# EAGLE design openautopihat (EAGLE 8.2.2)
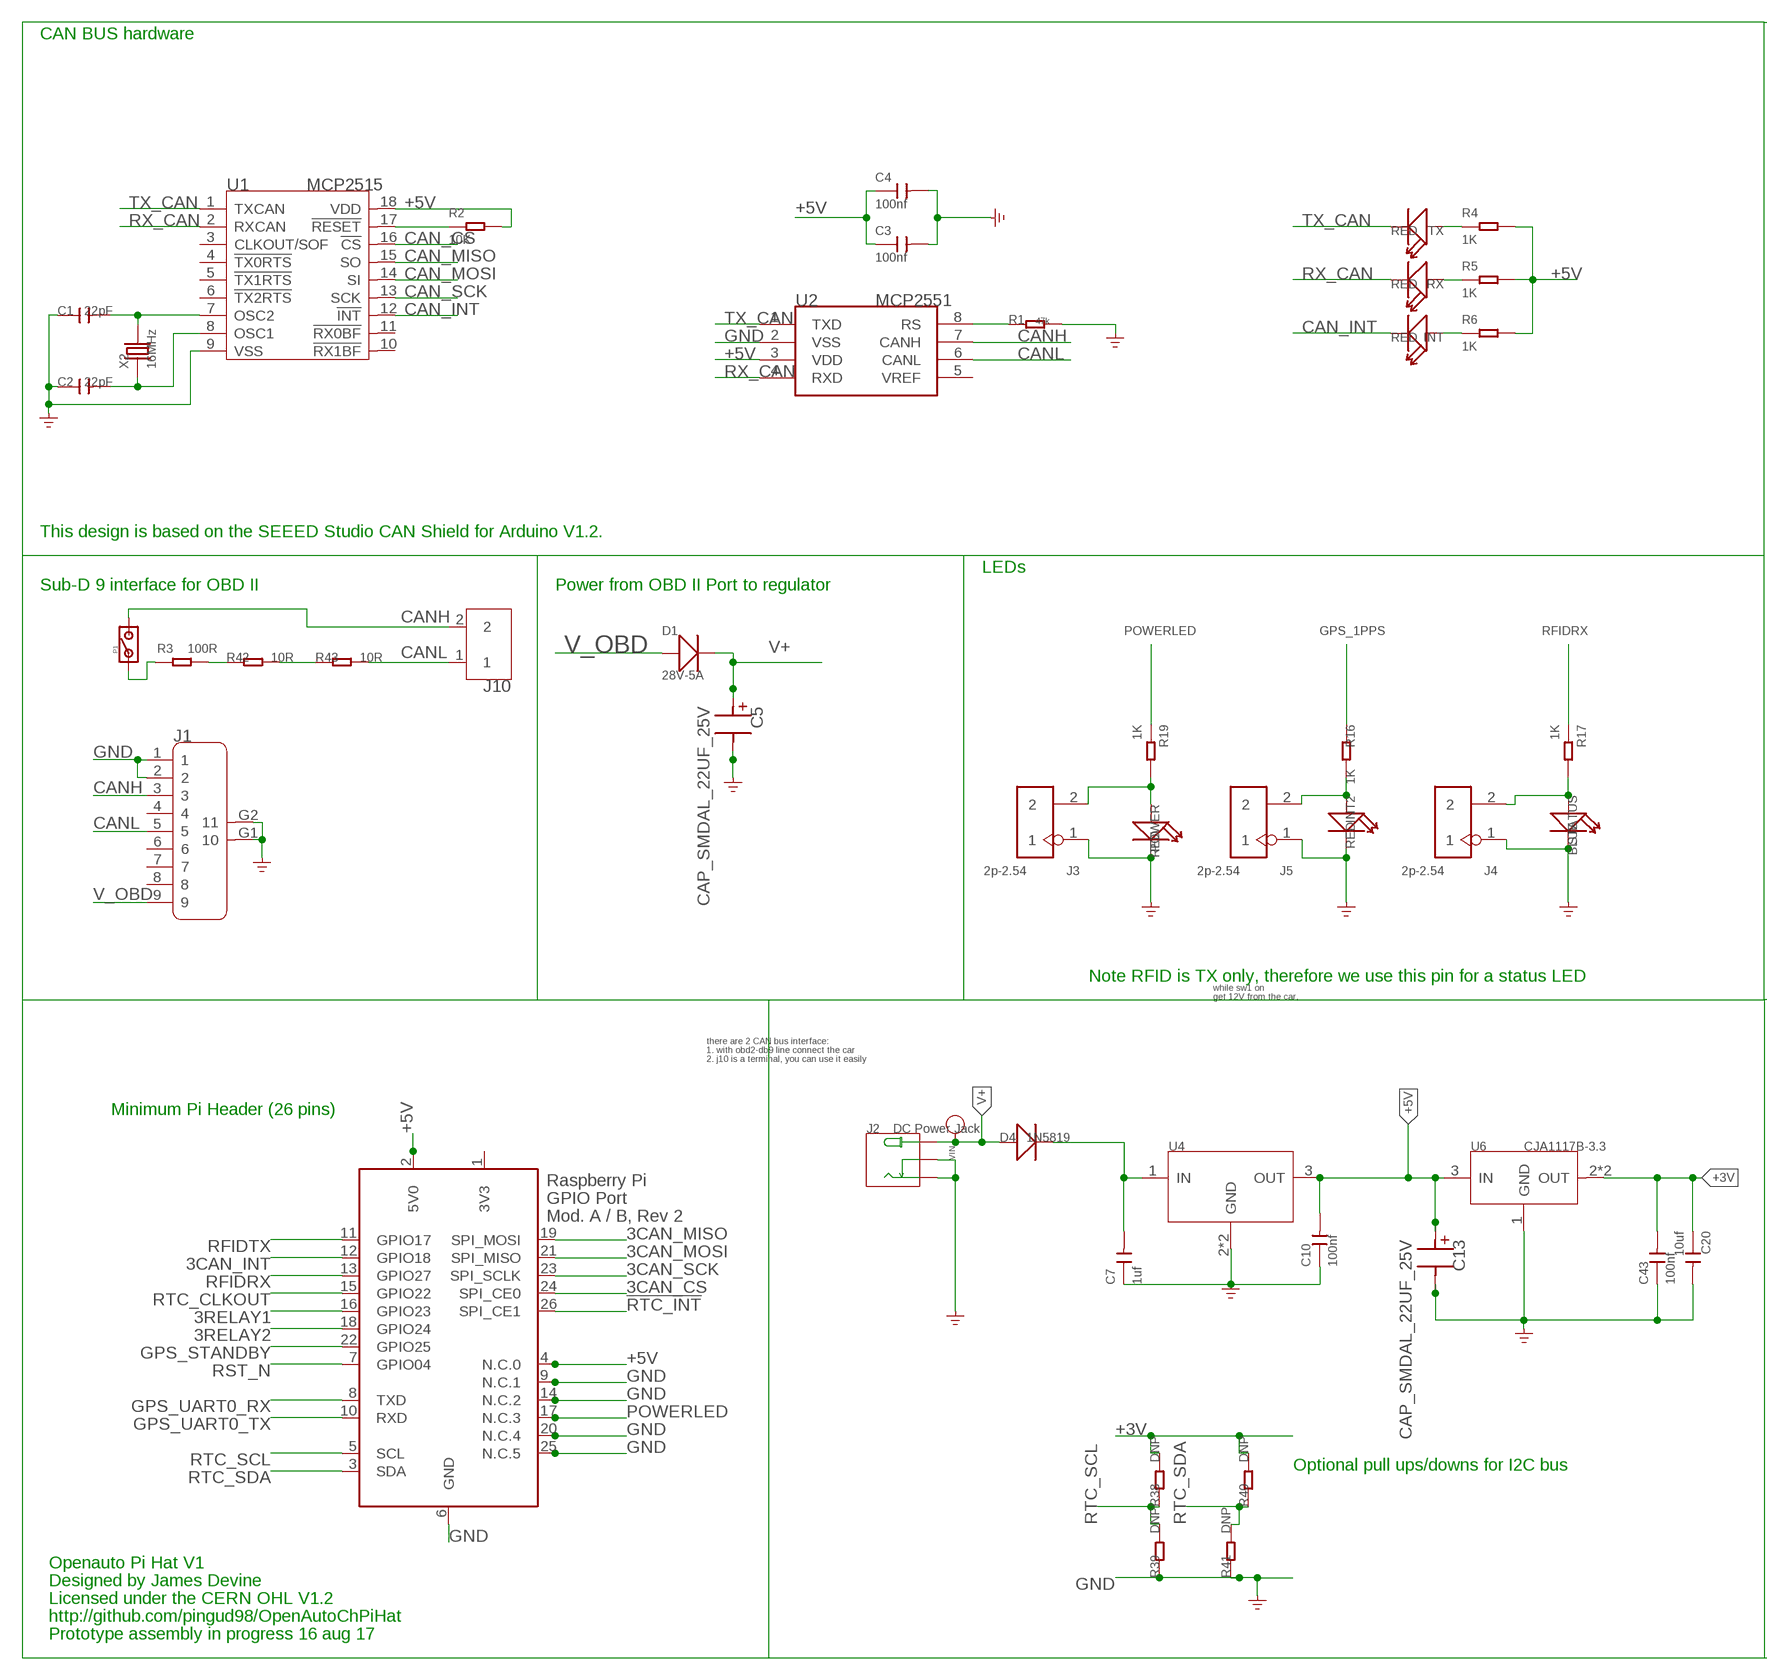
[diagram p0: schematic, sheet 1, part 1 of 2]
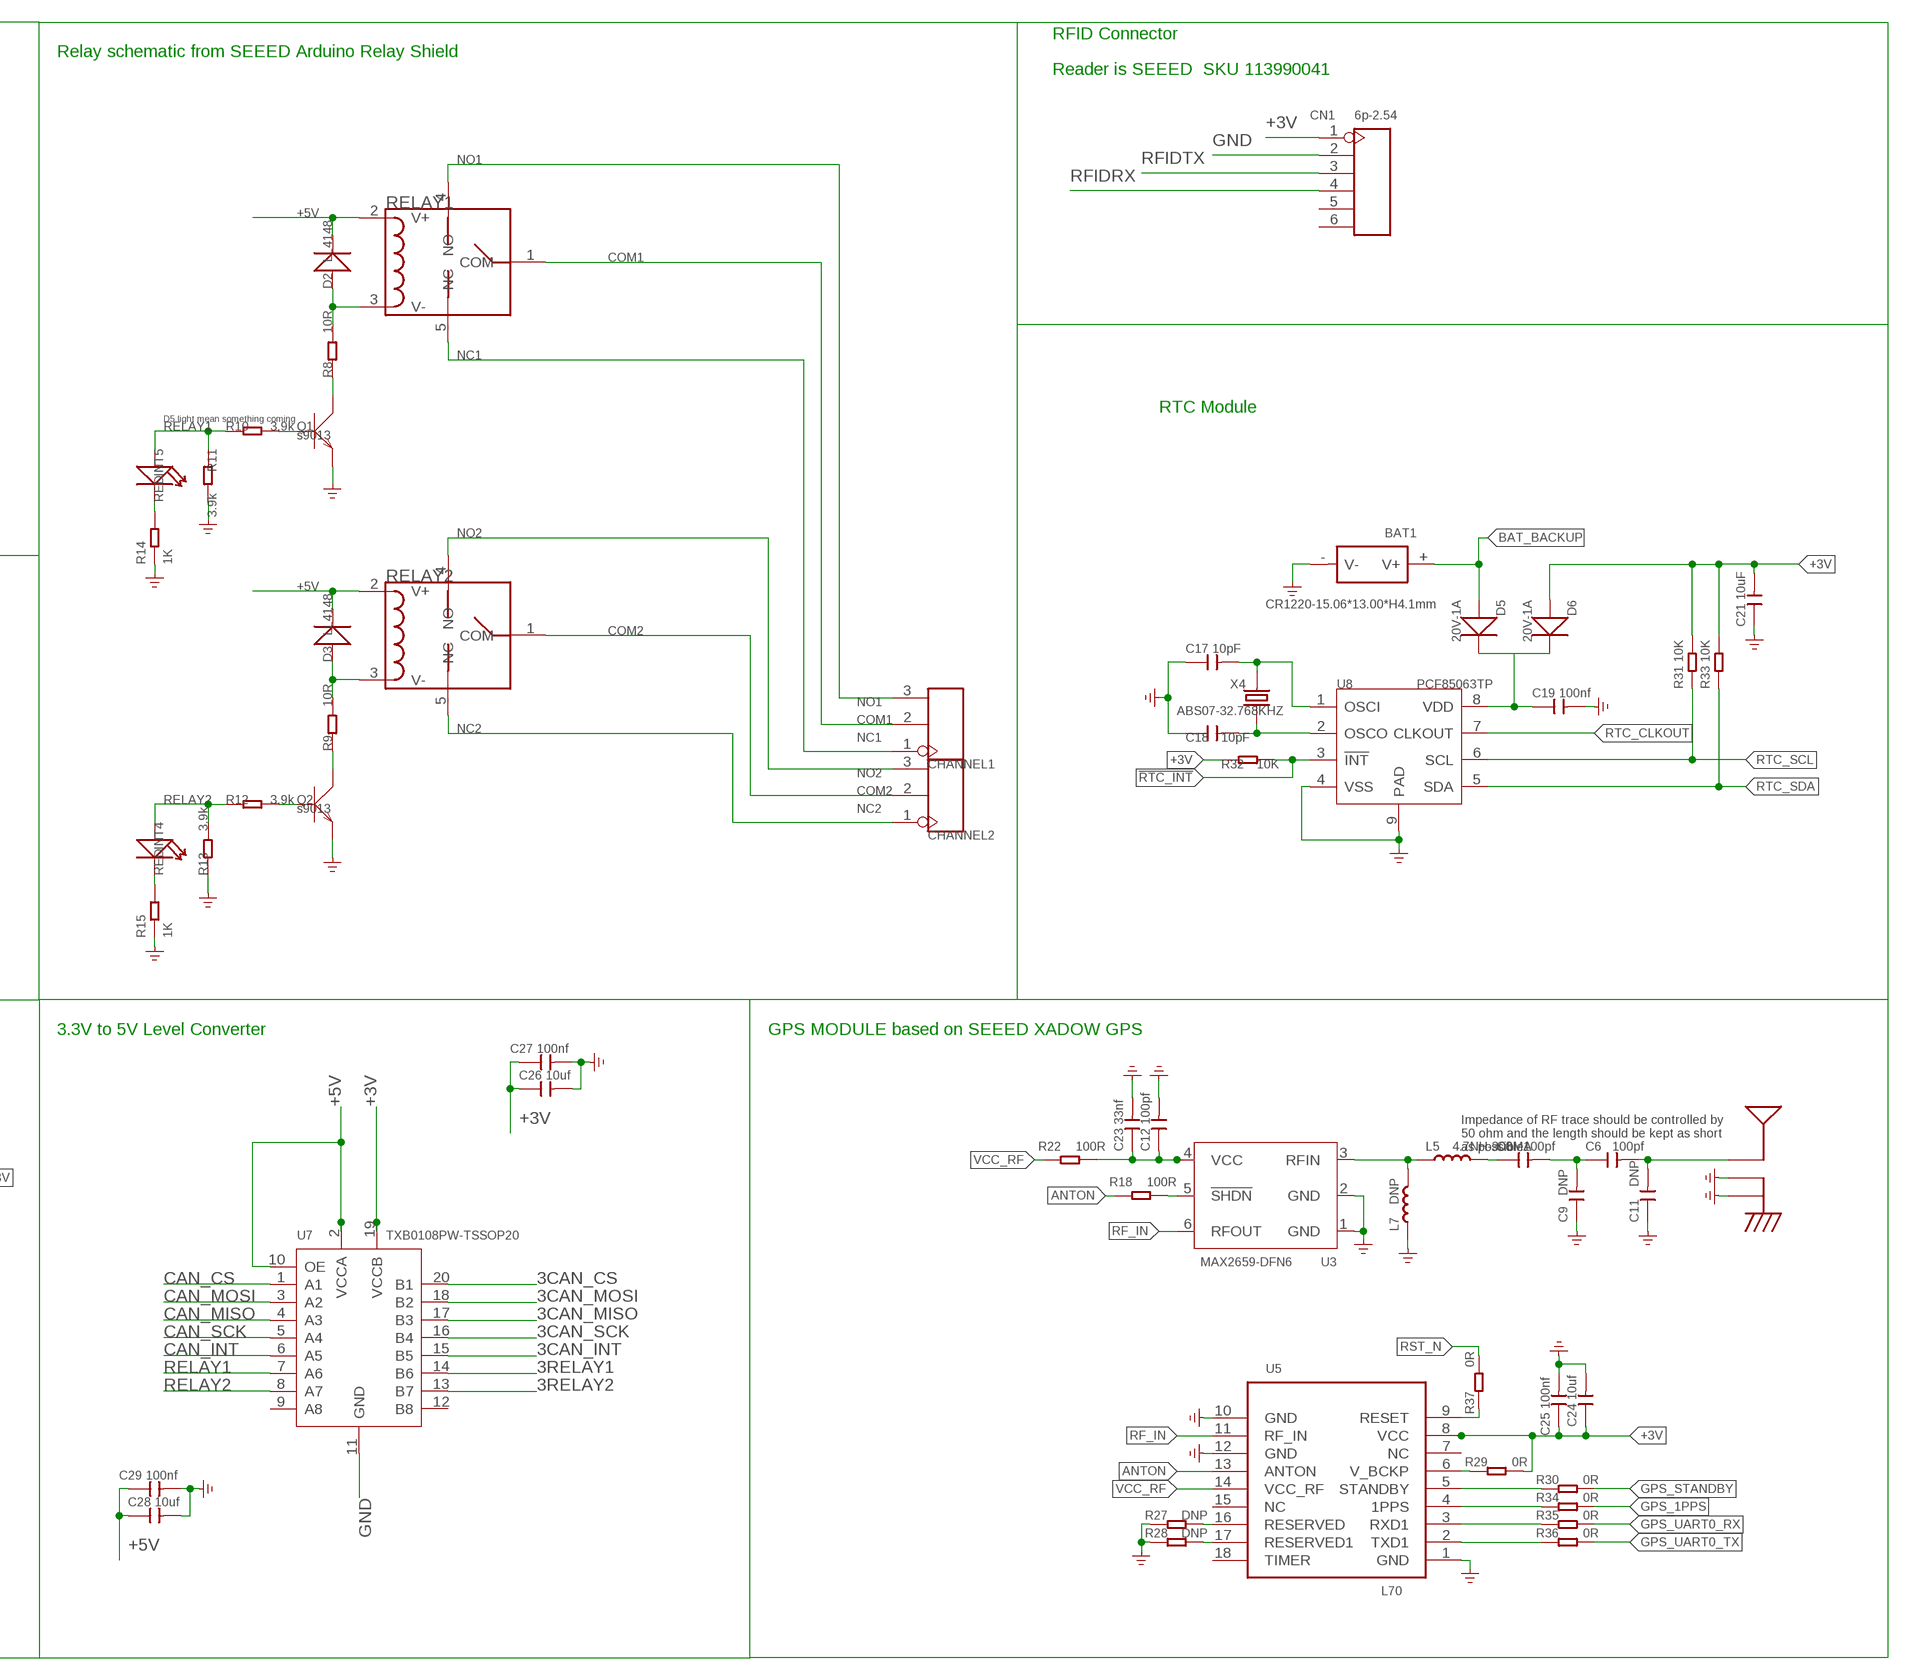
[diagram p1: schematic, sheet 1, part 2 of 2]

## Parts
ANT2  ACD-5036-A3-CC-S  [SMD_ANT5237]
BAT1  CR1220-15.06*13.00*H4.1mm  BAT-HOLDER'SMD-1220'  [BAT2P-SMD-16.4-CR1220]
C1  22pF  C-0603  [C0603]
C2  22pF  C-0603  [C0603]
C3  100nf  CERAMIC-100NF-50V-10%-X7R(0603)  [C0603]
C4  100nf  CERAMIC-100NF-50V-10%-X7R(0603)  [C0603]
C5  CAP_SMDAL_22UF_25V  [CAP_SMD_AL_D50]
C6  100pf  CERAMIC-100PF-50V-5%-NPO(0603)  [C0603]
C7  1uf  CERAMIC-1UF-25V-10%-X7R(0603)  [C0603]
C8  100pf  CERAMIC-100PF-50V-5%-NPO(0603)  [C0603]
C9  DNP  CAP-0201  [C0201]
C10  100nf  CERAMIC-100NF-50V-10%-X7R(0603)  [C0603]
C11  DNP  CAP-0201  [C0201]
C12  100pf  CERAMIC-100PF-50V-5%-NPO(0603)  [C0603]
C13  CAP_SMDAL_22UF_25V  [CAP_SMD_AL_D50]
C17  10pF  CAP-0402  [C0402]
C18  10pF  CAP-0402  [C0402]
C19  100nf  CERAMIC-100NF-50V-10%-X7R(0603)  [C0603]
C20  10uf  CERAMIC-10UF-25V-10%-X5R(0805)  [C0805]
C21  10uF  CAP-0805  [C0805]
C23  33nf  CERAMIC-33NF-50V-10%-X7R(0603)  [C0603]
C24  10uf  CERAMIC-10UF-25V-10%-X5R(0805)  [C0805]
C25  100nf  CERAMIC-100NF-50V-10%-X7R(0603)  [C0603]
C26  10uf  CERAMIC-10UF-25V-10%-X5R(0805)  [C0805]
C27  100nf  CERAMIC-100NF-50V-10%-X7R(0603)  [C0603]
C28  10uf  CERAMIC-10UF-25V-10%-X5R(0805)  [C0805]
C29  100nf  CERAMIC-100NF-50V-10%-X7R(0805)  [C0805]
C43  100nf  CERAMIC-100NF-50V-10%-X7R(0603)  [C0603]
CHANNEL1  SCREW-TERMINAL-3P'3.5'  [3P-3.5]
CHANNEL2  SCREW-TERMINAL-3P'3.5'  [3P-3.5]
CN1  6p-2.54  DIP-BLACK-FEMALE-HEADER-VERT(6P-2.54)  [H6-2.54]
D1  28V-5A  SMD-DIODE-SCHOTTKY-28V-5A(DO-214AA)  [DO-214AA]
D2  LL4148  D'1N4148-SMD'  [LL-34]
D3  LL4148  D'1N4148-SMD'  [LL-34]
D4  1N5819  D'DO-214AC'  [D2010]
D5  20V-1A  SMD-DIODE-SCHOTTKY-20V-1A(SOD-123)  [SOD-123]
D6  20V-1A  SMD-DIODE-SCHOTTKY-20V-1A(SOD-123)  [SOD-123]
INT  RED  LED'0603'  [LED-0603]
INT2  RED  LED'0603'  [LED-0603]
INT4  RED  LED'0603'  [LED-0603]
INT5  RED  LED'0603'  [LED-0603]
J1  DB9'MEAL'  [DB9-MEAL]
J2  DC Power Jack  DC-044  [DC-404]
J3  2p-2.54  DIP-BLACK-MALE-HEADER-VERT(2P-2.54)  [H2-2.54]
J4  2p-2.54  DIP-BLACK-MALE-HEADER-VERT(2P-2.54)  [H2-2.54]
J5  2p-2.54  DIP-BLACK-MALE-HEADER-VERT(2P-2.54)  [H2-2.54]
J10  SCREW-TERMINAL-2P5.0  [2P-5.0]
L5  4.7NH-300MA  SMD-INDUCTOR-4.7NH-0.3NH-300MA(0402)  [L0402]
L7  DNP  INDUCTOR/FERRITE-BEAD-0201  [L0201]
P1  PAD-JUMPER-2P  [2P-SMD-1.78X1.27]
POWER  RED  LED'0603'  [LED-0603]
Q1  s9013  TRANSISTOR-NPN-SOT23  [SOT23]
Q2  s9013  TRANSISTOR-NPN-SOT23  [SOT23]
R1  47k  R-0603  [0603]
R2  10K  SMD-RES-10K-1%-1/8W(0805)  [R0805]
R3  100R  SMD-RES-100R-5%-1/8W(0805)  [R0805]
R4  1K  SMD-RES-1K-1%-1/10W(0603)  [R0603]
R5  1K  SMD-RES-1K-1%-1/10W(0603)  [R0603]
R6  1K  SMD-RES-1K-1%-1/10W(0603)  [R0603]
R8  10R  R-0603  [R0603]
R9  10R  R-0603  [R0603]
R10  3.9k  R-0603  [R0603]
R11  3.9k  R-0603  [R0603]
R12  3.9k  R-0603  [R0603]
R13  3.9k  R-0603  [R0603]
R14  1K  SMD-RES-1K-1%-1/10W(0603)  [R0603]
R15  1K  SMD-RES-1K-1%-1/10W(0603)  [R0603]
R16  1K  R-0603  [R0603]
R17  1K  SMD-RES-1K-1%-1/10W(0603)  [R0603]
R18  100R  SMD-RES-100R-5%-1/8W(0805)  [R0805]
R19  1K  SMD-RES-1K-1%-1/10W(0603)  [R0603]
R22  100R  SMD-RES-100R-5%-1/8W(0805)  [R0805]
R27  DNP  RES-0201  [R0201]
R28  DNP  RES-0201  [R0201]
R29  0R  SMD-RES-0R-5%-1/10W(0603)  [R0603]
R30  0R  SMD-RES-0R-5%-1/10W(0603)  [R0603]
R31  10K  SMD-RES-10K-1%-1/8W(0805)  [R0805]
R32  10K  SMD-RES-10K-1%-1/8W(0805)  [R0805]
R33  10K  SMD-RES-10K-1%-1/8W(0805)  [R0805]
R34  0R  SMD-RES-0R-5%-1/10W(0603)  [R0603]
R35  0R  SMD-RES-0R-5%-1/10W(0603)  [R0603]
R36  0R  SMD-RES-0R-5%-1/10W(0603)  [R0603]
R37  0R  SMD-RES-0R-5%-1/10W(0603)  [R0603]
R38  DNP  R-0603  [R0603]
R39  DNP  R-0603  [R0603]
R40  DNP  R-0603  [R0603]
R41  DNP  R-0603  [R0603]
R42  10R  R-0603  [R0603]
R43  10R  R-0603  [R0603]
RELAY1  RELAY-HLS8L-DC5V-S-C  [5P-19.0X15.5X15.8H]
RELAY2  RELAY-HLS8L-DC5V-S-C  [5P-19.0X15.5X15.8H]
RX  RED  LED'0603'  [LED-0603]
STATUS  BLUE  LED'0603'  [LED-0603]
TX  RED  LED'0603'  [LED-0603]
U1  MCP2515  MCP2515-SOIC18  [SOIC18]
U2  MCP2551  MCP2551-SOIC8  [SOIC8-6.0]
U3  MAX2659-DFN6  AMPLIFIER-MAX2659  [DFN6-0.5-1.5X1.2X0.72MM]
U4  PMIC-ST-L7805CV(TO-220)  [TO-220]
U5  L70  MOUDLE-GPS-L70-HARDWARE  [LGA18-1.1-9.7X10.1X2.5MM]
U6  CJA1117B-3.3  PMIC-CJ1117'SOT89'  [SOT-89]
U7  TXB0108PW-TSSOP20  LOGIC-TXB0108PW(TSSOP20)  [TSSOP20-0.65-6.5X4.4MM]
U8  PCF85063TP  RTC-PCF85063TP  [HWSON8-0.5-2X3X0.75MM]
VIN  PAD-TEST-POINT'4545'  [TP_4545]
X1  RASPI_GPIO_AB_PIN  [RASPI_GPIO_AB_PIN]
X2  16MHz  CRYSTAL-HC49S  [HC49/S]
X4  ABS07-32.768KHZ  CRYSTAL-2P-3215  [X2-SMD-3.2X1.5X0.55MM]

## Nets
3CAN_CS: U7.20(B1) X1.24(SPI_CE0)
3CAN_INT: U7.15(B5) X1.12(GPIO18)
3CAN_MISO: U7.17(B3) X1.19(SPI_MOSI)
3CAN_MOSI: U7.18(B2) X1.21(SPI_MISO)
3CAN_SCK: U7.16(B4) X1.23(SPI_SCLK)
3RELAY1: U7.14(B6) X1.16(GPIO23)
3RELAY2: U7.13(B7) X1.18(GPIO24)
!RTC_INT: R32.2 U8.3(!INT) X1.26(SPI_CE1)
+3V: C20.1 C21.2 C24.1 C25.1 C26.1 C27.1 C43.2 CN1.1 D6.+ R29.1 R31.2 R32.1 R33.2 R38.2 R40.2 U5.8(VCC) U6.2(OUT) U6.4(OUT) U7.19(VCCB)
+5V [5V Line]: C3.1 C4.1 C10.2 C13.P$P C28.1 C29.1 D2.C(-) D3.C(-) R2.2 R4.2 R5.2 R6.2 RELAY1.2(V+) RELAY2.2(V+) U1.18(VDD) U2.3(VDD) U4.3(OUT) U6.3(IN) U7.2(VCCA) U7.10(OE) X1.2(5V0) X1.4(N.C.0)
ANTON: R18.2 U5.13(ANTON)
BAT_BACKUP: BAT1.+(V+) D5.+
CAN_CS: U1.16(!CS) U7.1(A1)
CAN_INT: INT.- U1.12(!INT) U7.6(A5)
CAN_MISO: U1.15(SO) U7.4(A3)
CAN_MOSI: U1.14(SI) U7.3(A2)
CAN_SCK: U1.13(SCK) U7.5(A4)
CANH: J1.3 J10.2 P1.2 U2.7(CANH)
CANL: J1.5 J10.1 R43.2 U2.6(CANL)
COM1: CHANNEL1.2 RELAY1.1(COM)
COM2: CHANNEL2.2 RELAY2.1(COM)
GND [Batt]: ANT2.GND1 ANT2.GND2 BAT1.-(V-) C1.1 C2.1 C3.2 C4.2 C5.P$M C7.1 C9.1 C10.1 C11.1 C12.2 C13.P$M C17.1 C18.1 C19.2 C20.2 C21.1 C23.2 C24.2 C25.2 C26.2 C27.2 C28.2 C29.2 C43.1 CN1.2 INT2.- J1.1 J1.2 J1.G1 J1.G2 J2.- J2.CDN J3.1 J4.1 J5.1 L7.1 POWER.- Q1.2(E) Q2.2(E) R1.2 R11.2 R13.1 R14.1 R15.1 R27.2 R28.2 R39.1 R41.1 STATUS.- U1.9(VSS) U2.2(VSS) U3.1(GND) U3.2(GND) U4.2(GND) U4.HEAT(GND) U5.1(GND) U5.10(GND) U5.12(GND) U6.1(GND) U7.11(GND) U8.4(VSS) U8.9(PAD) X1.6(GND) X1.9(N.C.1) X1.14(N.C.2) X1.20(N.C.4) X1.25(N.C.5) ; supply symbol labelled GND_POWER
GPS_1PPS: R16.1 R34.1
GPS_STANDBY: R30.1 X1.22(GPIO25)
GPS_UART0_RX: R35.1 X1.8(TXD)
GPS_UART0_TX: R36.1 X1.10(RXD)
N$2: R4.1 TX.+
N$4 [5V Line]: Q2.1(B) R12.2
N$5 [5V Line]: D3.A(+) R9.2 RELAY2.3(V-)
N$6 [5V Line]: Q1.3(C) R8.1
N$7 [5V Line]: D2.A(+) R8.2 RELAY1.3(V-)
N$8 [5V Line]: Q2.3(C) R9.1
N$9: INT2.+ J5.2 R16.2
N$10: J4.2 R17.2 STATUS.+
N$11: R3.1 R42.1
N$12: INT5.- R14.2
N$13: INT4.- R15.2
N$15: R5.1 RX.+
N$16: C1.2 U1.7(OSC2) X2.2
N$17: C2.2 U1.8(OSC1) X2.1
N$19: INT.+ R6.1
N$20: R1.1 U2.8(RS)
N$23 [5V Line]: Q1.1(B) R10.2
N$26 [Batt]: C7.2 D4.- U4.1(IN)
N$29: J3.2 POWER.+ R19.2
N$30: P1.1 R3.2
N$31: C6.1 C8.2 C9.2
N$32: ANT2.FEED C6.2 C11.2
N$33: L5.1 L7.2 U3.3(RFIN)
N$34: C8.1 L5.2
N$35: R18.1 U3.5(!SHDN)
N$36: C12.1 C23.1 R22.1 U3.4(VCC)
N$37: R27.1 U5.16(RESERVED)
N$38: R28.1 U5.17(RESERVED1)
N$39: R29.2 U5.6(V_BCKP)
N$40: C18.2 U8.2(OSCO) X4.1
N$41: C17.2 U8.1(OSCI) X4.2
N$42: R30.2 U5.5(STANDBY)
N$43: R34.2 U5.4(1PPS)
N$44: R37.2 U5.9(RESET)
N$45: R42.2 R43.1
N$49: C19.1 D5.- D6.- U8.8(VDD)
NC1: CHANNEL1.1 RELAY1.5(NC)
NC2: CHANNEL2.1 RELAY2.5(NC)
NO1: CHANNEL1.3 RELAY1.4(NO)
NO2: CHANNEL2.3 RELAY2.4(NO)
POWERLED: R19.1 X1.17(N.C.3)
RELAY1 [5V Line]: INT5.+ R10.1 R11.1 U7.7(A6)
RELAY2: INT4.+ R12.1 R13.2 U7.8(A7)
RF_IN: U3.6(RFOUT) U5.11(RF_IN)
RFIDRX: CN1.4 R17.1 X1.13(GPIO27)
RFIDTX: CN1.3 X1.11(GPIO17)
RST_N: R2.1 R37.1 U1.17(!RESET) X1.7(GPIO04)
RTC_CLKOUT: U8.7(CLKOUT) X1.15(GPIO22)
RTC_SCL: R31.1 R38.1 R39.2 U8.6(SCL) X1.5(SCL)
RTC_SDA: R33.1 R40.1 R41.2 U8.5(SDA) X1.3(SDA)
RX_CAN: RX.- U1.2(RXCAN) U2.4(RXD)
RXD1: R35.2 U5.3(RXD1)
TX_CAN: TX.- U1.1(TXCAN) U2.1(TXD)
TXD1: R36.2 U5.2(TXD1)
V+ [Batt]: C5.P$P D1.- D4.+ J2.+ VIN.T
V_OBD [Batt]: D1.+ J1.9
VCC_RF: R22.2 U5.14(VCC_RF)
Unconnected: CN1.5 CN1.6 J1.4 J1.6 J1.7 J1.8 U1.3(CLKOUT/SOF) U1.4(!TX0RTS) U1.5(!TX1RTS) U1.6(!TX2RTS) U1.10(!RX1BF) U1.11(!RX0BF) U2.5(VREF) U5.7(NC) U5.15(NC) U5.18(TIMER) U7.9(A8) U7.12(B8)

## Notes on the sheet
- CAN BUS hardware | RFID Connector
- Relay schematic from SEEED Arduino Relay Shield
- Reader is SEEED  SKU 113990041
- RTC Module
- D5 light mean something coming
- This design is based on the SEEED Studio CAN Shield for Arduino V1.2.
- LEDs
- Sub-D 9 interface for OBD II | Power from OBD II Port to regulator
- Note RFID is TX only, therefore we use this pin for a status LED
- while sw1 on
- get 12V from the car,
- 3.3V to 5V Level Converter | GPS MODULE based on SEEED XADOW GPS
- there are 2 CAN bus interface:
- 1. with obd2-db9 line connect the car
- 2. j10 is a terminal, you can use it easily
- Minimum Pi Header (26 pins)
- Impedance of RF trace should be controlled by 
  50 ohm and the length should be kept as short 
  as possible.
- short route
- Optional pull ups/downs for I2C bus
- Openauto Pi Hat V1
- Designed by James Devine
- Licensed under the CERN OHL V1.2
- http://github.com/pingud98/OpenAutoChPiHat
- Prototype assembly in progress 16 aug 17

## Power pins joined to a net without a drawn wire
3V3: X1.1(3V3)

## Library data of the parts
ANT2 = Seeed-OPL-2017-01-Antenna-akita:ACD-5036-A3-CC-S: SMD Built-in Antenna for GPSz;3P-5.2*3.7*0.7mm Inpad;ACD-5036-A3-CC-S SKU: 3180020
BAT1 = Connector-new:BAT-HOLDER: BAT2P-13.5-CR1220:320170002;BAT2P-SMD-20.5-CR1632:320170007;METAL-CR2032-D20.0*H6.3MM:320170003;METAL-CR2032-SMD:320170006;PLASTIC-CR1220-L15.06*W13.0*H4.1MM:320170000;PLASTIC-CR2032-L25.2*W15.6*H5.2MM:320170005;BAT2P-11.55-D12.55-CR1220:313010022
C1 C2 = Discrete:C*: Ceramic Capacitors
C3 C4 C10 C19 C25 C27 C43 = Seeed-Capacitor:CERAMIC-100NF-50V-10%-X7R(0603): 302010138; MPN: CC0603KRX7R9BB104
C5 C13 = Seeed-OPL-2017-01-Capacitor-akita:CAP_SMDAL_22UF_25V: SMD CAP Aluminum 22uF-25V;D5.0*H5.4mm SKU: 302030003
C6 C8 C12 = Seeed-Capacitor:CERAMIC-100PF-50V-5%-NPO(0603): 302010076; MPN: CC0603JRNPO9BN101
C7 = Seeed-Capacitor:CERAMIC-1UF-25V-10%-X7R(0603): 302010139; MPN: CC0603KRX7R8BB105
C9 C11 C17 C18 C21 = Discrete-new:CAP: Ceramic Capacitors
C20 C24 C26 C28 = Seeed-Capacitor:CERAMIC-10UF-25V-10%-X5R(0805): 302010178; MPN: CC0805KKX5R8BB106
C23 = Seeed-Capacitor:CERAMIC-33NF-50V-10%-X7R(0603): 302010088; MPN: CC0603KRX7R9BB333
C29 = Seeed-Capacitor:CERAMIC-100NF-50V-10%-X7R(0805): 302010165; MPN: CC0805KRX7R9BB104
CHANNEL1 CHANNEL2 = Connector :SCREW-TERMINAL-3P
CN1 = Seeed-Connector:DIP-BLACK-FEMALE-HEADER-VERT(6P-2.54): 320030060; MPN: F185-1106A1BSYC1
D1 = Seeed-Diode:SMD-DIODE-SCHOTTKY-28V-5A(DO-214AA): 304020021; MPN: SS54B
D2-D4 = discrete:D*
D5 D6 = Seeed-Diode:SMD-DIODE-SCHOTTKY-20V-1A(SOD-123): 304020034; MPN: B5819W
INT INT2 INT4 INT5 POWER RX STATUS TX = Discrete:LED*
J1 = Connector:DB9
J2 = For_Test_Albert:DC-044
J3-J5 = Seeed-Connector:DIP-BLACK-MALE-HEADER-VERT(2P-2.54): 320020016; MPN: P125-1102A0BS116A1
J10 = Connector:SCREW-TERMINAL-2P
L5 = Seeed-Inductor:SMD-INDUCTOR-4.7NH-0.3NH-300MA(0402): 303010037; MPN: LQG15HS4N7S02
L7 = Discrete-new:INDUCTOR/FERRITE-BEAD
P1 = Discrete:PAD-JUMPER-2P
Q1 Q2 = discrete:TRANSISTOR-NPN*: NPN audion
R1 = Discrete:R*
R2 R31-R33 = Seeed-Resistor:SMD-RES-10K-1%-1/8W(0805): 301010361; MPN: RC0805FR-0710KL
R3 R18 R22 = Seeed-Resistor:SMD-RES-100R-5%-1/8W(0805): 301010319; MPN: RC0805JR-07100RL
R4-R6 R14 R15 R17 R19 = Seeed-Resistor:SMD-RES-1K-1%-1/10W(0603): 301010298; MPN: RC0603FR-071KL
R8-R13 R16 R38-R43 = discrete:R*
R27 R28 = Discrete-new:RES
R29 R30 R34-R37 = Seeed-Resistor:SMD-RES-0R-5%-1/10W(0603): 301010292; MPN: RC0603JR-070RL
RELAY1 RELAY2 = discrete:RELAY-HLS8L-DC5V-S-C
U1 = IC:MCP2515: Stand-Alone CAN Controller With SPI Interface
U2 = IC:MCP2551: High-Speed CAN Transceiver http://ww1.microchip.com/downloads/en/devicedoc/21667f.pdf
U3 = IC-new:AMPLIFIER-MAX2659: GPS/GNSS Low-Noise Amplifier; MPN: MAX2659
U4 = Seeed-IC:PMIC-ST-L7805CV(TO-220): 310030010; MPN: L7805CV
U5 = moudle-new:MOUDLE-GPS-L70-HARDWARE: L70 GPS module; MPN: L70
U6 = IC-new:PMIC-CJ*1117: Low Drop Fixed And Adjustable Positive Voltage Regulators http://www.datasheetcatalog.org/datasheet/SGSThomsonMicroelectronics/mXuqtqv.pdf
U7 = Seeed-IC:LOGIC-TXB0108PW(TSSOP20): 310050024; MPN: TXB0108PW
U8 = IC-new:RTC-PCF85063TP
VIN = discrete:PAD-TEST-POINT; PARTNO: DNP
X1 = raspberrypi_bastelstube_v13:RASPI_GPIO_AB: Only the 2x13 header connector, nothing else
X2 = Discrete:CRYSTAL*: CRYSTAL
X4 = Discrete-new:CRYSTAL-2P

## Net classes
0 default: width 0.152 mm, drill 0.152 mm, clearance 0.152 mm
1 Batt: width 0.305 mm, drill 0.152 mm, clearance 0.152 mm
2 5V Line: width 0.203 mm, drill 0.152 mm, clearance 0.152 mm

## Board
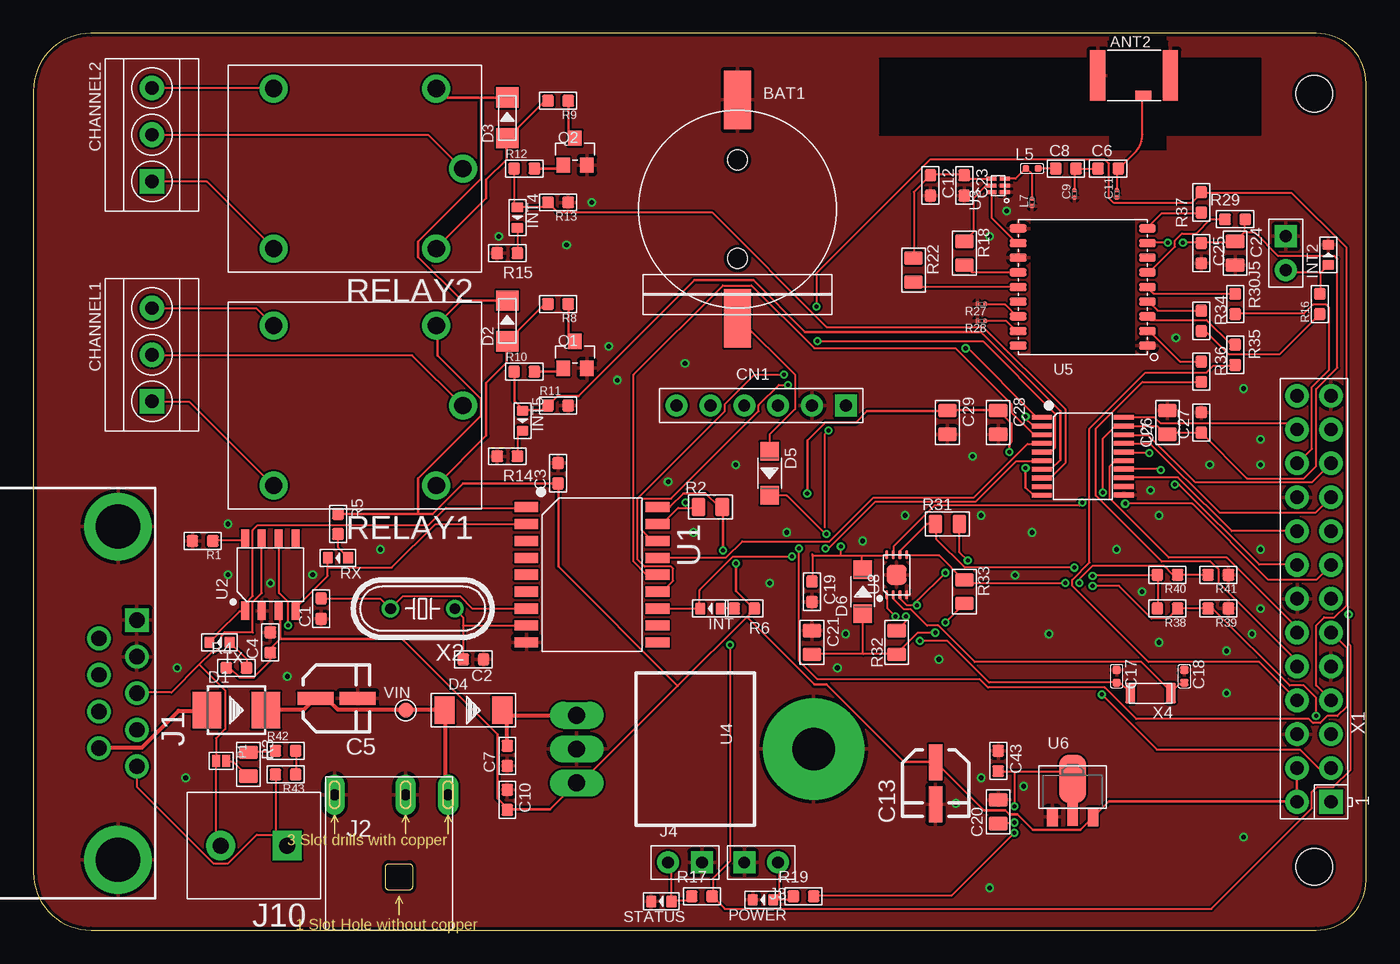
[diagram p2: board, top side]
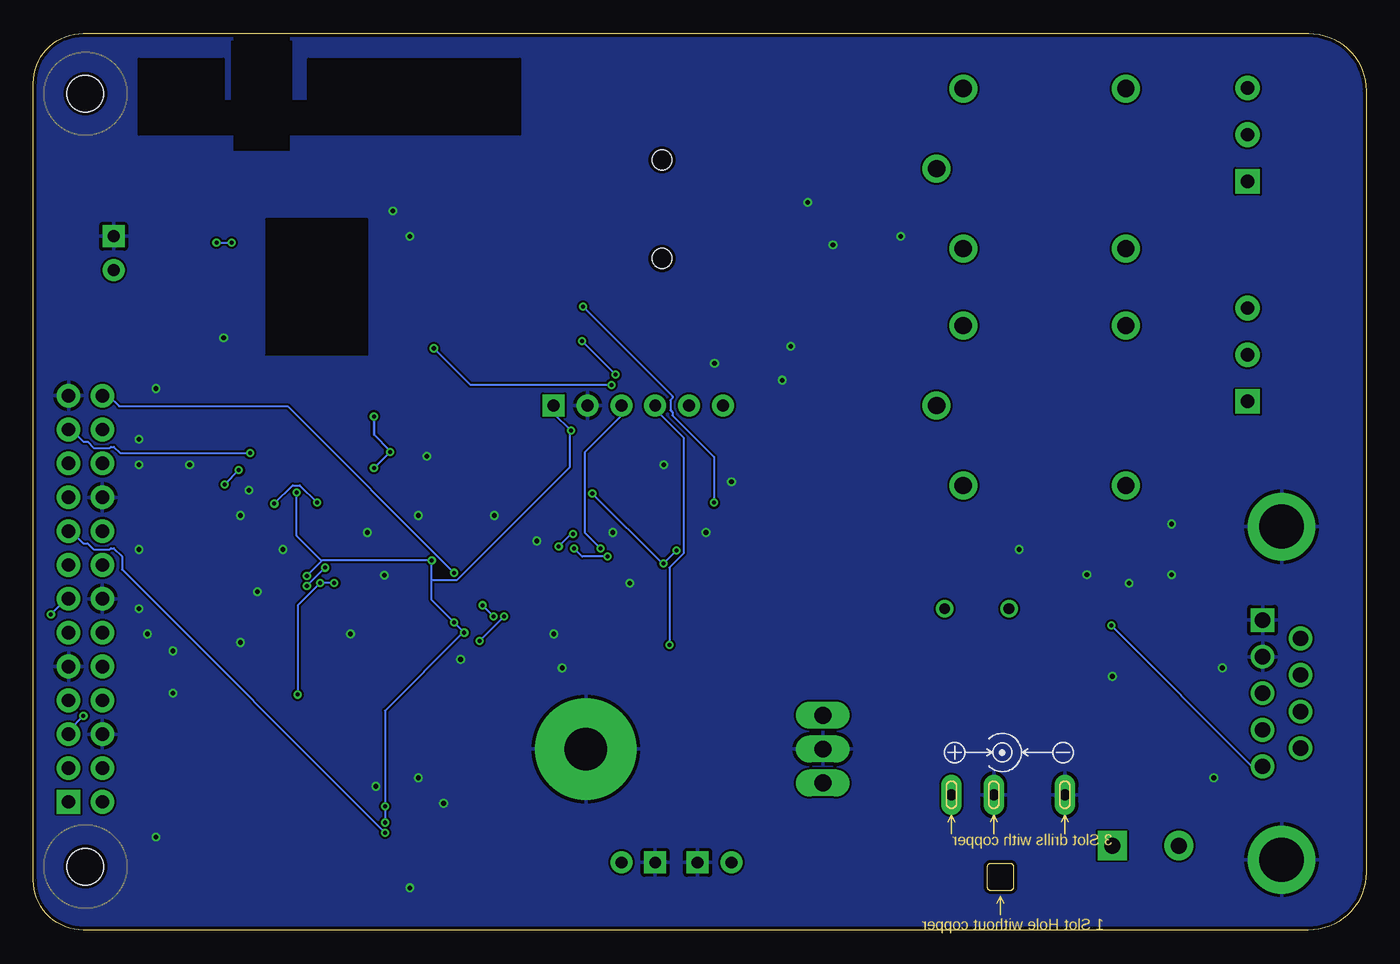
[diagram p3: board, bottom side, seen from below]

Size 100 x 67.3 mm. Coordinates in mm from the lower left corner, seen from the top.
Outline: 96.26,67.3 4.32,67.3 arc90 0,62.98 0,4.34 arc90 4.34,0 96.25,0 arc90 100,3.75 100,63.56 arc90 96.26,67.3
Copper layers (1*16): Top 0.035mm / dielectric 1.5mm / Bottom 0.035mm
Design rules "SeeedStudio_2layer_DRU_no_angle_20140221": minimum track width 6mil, minimum drill 12mil, track to track 6mil, track to pad 6mil, pad to pad 6mil, via to via 6mil, smd to smd 0mil, copper to edge 10mil, drill to drill 10mil, minimum pad ring 10mil, minimum via ring 6mil, stop-mask expansion 2mil, vias tented up to drill 100mil, thermal gap 10mil
Holes 2.75 mm at 96.09,4.77 96.09,62.77
tKeepout: area 63.5,59.7 to 82.5,66.7; area 82.5,59.7 to 92.1,66.7; area 74.9,43.2 to 82.5,53.3
bKeepout: area 63.5,59.7 to 82.5,66.7; area 82.5,59.7 to 92.1,66.7; area 74.9,43.2 to 82.5,53.3; area 74.9,43.2 to 82.5,53.3
tRestrict: area 82.5,59.7 to 92.1,66.7; area 63.5,59.7 to 82.5,66.7; area 74.9,43.2 to 82.5,53.3
bRestrict: area 63.5,59.7 to 82.5,66.7; area 82.5,59.7 to 92.1,66.7; area 74.9,43.2 to 82.5,53.3

### Footprints (pad centres in the part's own frame; a part is rotated, then mirrored left to right if it is on the bottom)
SMD_ANT5237 = smd 0.75 x 1.2: FEED 1.525,0.7 | smd 3.8 x 1.15: GND1 0,2.725; GND2 0,-2.725
BAT2P-SMD-16.4-CR1220 = smd 2 x 4.4: + 0,-8.2; - 0,8.2 | hole 1.5: 0,3.7; 0,-3.7
C0603 = smd 0.889 x 0.889: 1 -0.762,0; 2 0.762,0
C0603' = smd 0.889 x 0.889: 1 0,0.762; 2 0,-0.762
CAP_SMD_AL_D50 = smd 1 x 2.7: P$M 0,-1.6; P$P 0,1.56
C0201 = smd 0.279 x 0.318: 1 -0.279,0; 2 0.279,0
C0402 = smd 0.635 x 0.635: 1 0,0.484; 2 0,-0.484
C0805 = smd 1.397 x 1.016: 1 0,0.889; 2 0,-0.889
3P-3.5 = drill 1 pad 1.85 square: 1 0,-3.5 | drill 1 pad 1.85: 2 0,0; 3 0,3.5
H6-2.54 = drill 0.889 pad 1.651 square: 1 0,6.35 | drill 0.889 pad 1.651: 2 0,3.81; 3 0,1.27; 4 0,-1.27; 5 0,-3.81; 6 0,-6.35
DO-214AA = smd 2.159 x 2.743: + -2.21,0; - 2.21,0
LL-34 = smd 1.524 x 1.676: A -1.524,0; C 1.524,0
D2010 = smd 1.524 x 2.032: + -2.159,0; - 2.159,0
SOD-123 = smd 1.397 x 1.397: + -1.651,0; - 1.651,0
LED-0603 = smd 0.762 x 0.889: + -0.762,0; - 0.762,0
DB9-MEAL = drill 1.143 pad 1.778 square: 1 -5.486,1.422 | drill 1.143 pad 1.778: 2 -2.743,1.422; 3 0,1.422; 4 2.743,1.422; 5 5.486,1.422; 6 -4.115,-1.422; 7 -1.372,-1.422; 8 1.372,-1.422; 9 4.115,-1.422 | drill 3.302 pad 5.08: G1 12.497,0; G2 -12.497,0
DC-404 = drill 0.813 pad 1.524 long: + 3.175,10.16; - -5.334,10.16; CDN 0,10.16
H2-2.54 = drill 0.889 pad 1.651 square: 1 0,1.27 | drill 0.889 pad 1.651: 2 0,-1.27
2P-5.0 = drill 1.2 pad 2.184 square: 1 0,0 | drill 1.2 pad 2.184: 2 5,0
L0402 = smd 0.5 x 0.5: 1 -0.463,0; 2 0.463,0
L0201 = smd 0.279 x 0.318: 1 -0.279,0; 2 0.279,0
2P-SMD-1.78X1.27 = smd 0.889 x 0.61: 1 0,0.381; 2 0,-0.381
SOT23 = smd 1.016 x 1.143: 1 -0.889,-1.016; 2 0.889,-1.016; 3 0,1.016
0603 = smd 0.889 x 0.889: 1 -0.762,0; 2 0.762,0
R0805 = smd 1.397 x 1.016: 1 0,0.889; 2 0,-0.889
R0603 = smd 0.889 x 0.889: 1 0,0.762; 2 0,-0.762
R0603' = smd 0.889 x 0.889: 1 -0.762,0; 2 0.762,0
R0201 = smd 0.279 x 0.318: 1 -0.279,0; 2 0.279,0
5P-19.0X15.5X15.8H = drill 1.3 pad 2.1: 1 -8.1,0; 2 -6.1,-6; 3 -6.1,6; 4 6.1,-6; 5 6.1,6
SOIC18 = smd 0.762 x 1.778: 1 -5.08,-4.915; 2 -3.81,-4.915; 3 -2.54,-4.915; 4 -1.27,-4.915; 5 0,-4.915; 6 1.27,-4.915; 7 2.54,-4.915; 8 3.81,-4.915; 9 5.08,-4.915; 10 5.08,4.915; 11 3.81,4.915; 12 2.54,4.915; 13 1.27,4.915; 14 0,4.915; 15 -1.27,4.915; 16 -2.54,4.915; 17 -3.81,4.915; 18 -5.08,4.915
SOIC8-6.0 = smd 0.6 x 1.4: 1 -1.905,-2.7; 2 -0.635,-2.7; 3 0.635,-2.7; 4 1.905,-2.7; 5 1.905,2.7; 6 0.635,2.7; 7 -0.635,2.7; 8 -1.905,2.7
DFN6-0.5-1.5X1.2X0.72MM = smd 0.3 x 0.75: 1 -0.5,-0.5; 2 0,-0.5; 3 0.5,-0.5; 4 0.5,0.5; 5 0,0.5; 6 -0.5,0.5
TO-220 = drill 1.27 pad 2.032 long: 1 -2.54,-11.43; 2 0,-11.43; 3 2.54,-11.43 | drill 3.2 pad 7.62: HEAT 0,6.35
LGA18-1.1-9.7X10.1X2.5MM = smd 1.27 x 0.635: 1 4.85,-4.4; 2 4.85,-3.3; 3 4.85,-2.2; 4 4.85,-1.1; 5 4.85,0; 6 4.85,1.1; 7 4.85,2.2; 8 4.85,3.3; 9 4.85,4.4; 10 -4.85,4.4; 11 -4.85,3.3; 12 -4.85,2.2; 13 -4.85,1.1; 14 -4.85,0; 15 -4.85,-1.1; 16 -4.85,-2.2; 17 -4.85,-3.3; 18 -4.85,-4.4
SOT-89 = smd 0.8 x 1.4: 1 -1.524,-1.905; 3 1.524,-1.905 | smd 0.8 x 1.9: 2 0,-1.651 | smd 2.032 x 3.65: 4 0,0.94
TSSOP20-0.65-6.5X4.4MM = smd 0.35 x 1.5: 1 -2.925,-3.065; 2 -2.275,-3.065; 3 -1.625,-3.065; 4 -0.975,-3.065; 5 -0.325,-3.065; 6 0.325,-3.065; 7 0.975,-3.065; 8 1.625,-3.065; 9 2.275,-3.065; 10 2.925,-3.065; 11 2.91,3.065; 12 2.26,3.065; 13 1.61,3.065; 14 0.96,3.065; 15 0.325,3.065; 16 -0.325,3.065; 17 -0.975,3.065; 18 -1.625,3.065; 19 -2.275,3.065; 20 -2.925,3.065
HWSON8-0.5-2X3X0.75MM = smd 0.25 x 0.7: 1 -0.75,-1.5; 2 -0.25,-1.5; 3 0.25,-1.5; 4 0.75,-1.5; 5 0.75,1.5; 6 0.25,1.5; 7 -0.25,1.5; 8 -0.75,1.5 | smd 1.5 x 1.5: 9 0,0
TP_4545 = smd 1.143 x 1.143: T 0,0
RASPI_GPIO_AB_PIN = drill 1 pad 1.778 square: 1 -15.24,-1.27 | drill 1 pad 1.778: 2 -15.24,1.27; 3 -12.7,-1.27; 4 -12.7,1.27; 5 -10.16,-1.27; 6 -10.16,1.27; 7 -7.62,-1.27; 8 -7.62,1.27; 9 -5.08,-1.27; 10 -5.08,1.27; 11 -2.54,-1.27; 12 -2.54,1.27; 13 0,-1.27; 14 0,1.27; 15 2.54,-1.27; 16 2.54,1.27; 17 5.08,-1.27; 18 5.08,1.27; 19 7.62,-1.27; 20 7.62,1.27; 21 10.16,-1.27; 22 10.16,1.27; 23 12.7,-1.27; 24 12.7,1.27; 25 15.24,-1.27; 26 15.24,1.27
HC49/S = drill 0.813: 1 -2.413,0; 2 2.413,0
X2-SMD-3.2X1.5X0.55MM = smd 0.762 x 1.524: 1 -1.524,0; 2 1.524,0

### Placement (x,y rotation side)
ANT2  82.58,64.14 270 top
BAT1  52.83,54.1 0 top
C1  21.59,24.13 90 top
C2  33.02,20.32 180 top
C3  100nf  [C0603']  39.37,34.29 180 top
C4  100nf  [C0603']  17.78,21.59 180 top
C5  22.73,17.4 90 top
C6  100pf  [C0603']  80.64,57.15 90 top
C7  1uf  [C0603']  35.56,13.08 180 top
C8  100pf  [C0603']  77.47,57.15 90 top
C9  78.11,55.24 90 top
C10  100nf  [C0603']  35.56,9.78 0 top
C11  81.28,55.24 90 top
C12  100pf  [C0603']  67.31,55.88 0 top
C13  67.69,11.05 0 top
C17  81.28,19.05 0 top
C18  86.36,19.05 0 top
C19  100nf  [C0603']  58.42,25.4 0 top
C20  72.39,8.89 180 top
C21  58.42,21.59 0 top
C23  33nf  [C0603']  69.85,55.88 0 top
C24  90.17,50.8 0 top
C25  100nf  [C0603']  87.63,50.8 0 top
C26  85.09,38.1 180 top
C27  100nf  [C0603']  87.63,38.1 180 top
C28  72.39,38.1 0 top
C29  68.58,38.1 0 top
C43  100nf  [C0603']  72.39,12.7 0 top
CHANNEL1  8.89,43.18 0 top
CHANNEL2  8.89,59.69 0 top
CN1  54.61,39.37 270 top
D1  15.24,16.51 0 top
D2  35.56,45.72 90 top
D3  35.56,60.96 90 top
D4  33.02,16.51 0 top
D5  55.24,34.29 270 top
D6  62.23,25.4 90 top
INT  50.8,24.13 180 top
INT2  97.16,50.67 90 top
INT4  36.32,53.47 270 top
INT5  36.7,38.23 270 top
J1  6.35,17.78 270 top
J2  27.94,0 0 top
J3  54.61,5.08 90 top
J4  48.9,5.08 270 top
J5  93.98,50.8 0 top
J10  19.05,6.35 180 top
L5  74.93,57.15 0 top
L7  74.93,54.61 90 top
P1  14.1,12.7 270 top
POWER  54.74,2.29 180 top
Q1  40.64,43.18 0 top
Q2  40.64,58.42 0 top
R1  12.7,29.21 180 top
R2  50.8,31.75 90 top
R3  16.13,12.45 0 top
R4  15.24,19.68 270 top
R5  22.86,30.48 180 top
R6  53.34,24.13 90 top
R8  10R  [R0603']  39.37,46.99 180 top
R9  10R  [R0603']  39.37,62.23 180 top
R10  3.9k  [R0603']  36.83,41.91 0 top
R11  3.9k  [R0603']  39.37,39.37 0 top
R12  3.9k  [R0603']  36.83,57.15 0 top
R13  3.9k  [R0603']  39.37,54.61 180 top
R14  35.56,35.56 90 top
R15  35.56,50.8 90 top
R16  1K  [R0603']  96.52,46.99 90 top
R17  50.16,2.54 270 top
R18  69.85,50.8 0 top
R19  57.78,2.54 270 top
R22  66.04,49.53 0 top
R27  71.12,46.99 180 top
R28  71.12,45.72 180 top
R29  90.17,53.34 270 top
R30  90.17,46.99 180 top
R31  68.58,30.48 90 top
R32  64.77,21.59 180 top
R33  69.85,25.4 0 top
R34  87.63,45.72 180 top
R35  90.17,43.18 180 top
R36  87.63,41.91 180 top
R37  87.63,54.61 0 top
R38  DNP  [R0603']  85.09,24.13 180 top
R39  DNP  [R0603']  88.9,24.13 180 top
R40  DNP  [R0603']  85.09,26.67 180 top
R41  DNP  [R0603']  88.9,26.67 180 top
R42  10R  [R0603']  18.92,13.46 0 top
R43  10R  [R0603']  18.92,11.68 180 top
RELAY1  24.13,39.37 180 top
RELAY2  24.13,57.15 180 top
RX  22.86,27.94 180 top
STATUS  47.12,2.16 180 top
TX  13.97,21.59 180 top
U1  41.91,26.67 270 top
U2  17.78,26.67 0 top
U3  72.39,55.88 90 top
U4  52.2,13.59 270 top
U5  78.74,48.26 0 top
U6  77.98,10.41 0 top
U7  78.74,35.56 270 top
U8  64.77,26.67 0 top
VIN  27.94,16.51 0 top
X1  96.09,24.87 90 top
X2  29.21,24.13 180 top
X4  83.82,17.78 180 top

### Tracks (layer width: path | path; a pad name or v marks a point on that pad's centre or on a via)
3CAN_CS
  Top 0.152: U7.20 81.84,38.48 84.12,38.48 84.58,38.02 94.34,38.02 94.79,37.57 X1.24
3CAN_INT
  Top 0.152: U7.15 81.76,35.2 81.15,35.2 80.77,34.82 80.77,32.38 85.19,27.96 89.53,27.96 94.79,22.71 94.79,22.33 X1.12
3CAN_MISO
  Top 0.152: U7.17 81.84,36.5 83.82,36.5 89,31.32 96.16,31.32 97.31,32.46 X1.19
3CAN_MOSI
  Top 0.152: X1.21 95.94,33.6 87.17,33.6 83.67,37.11 81.84,37.11 U7.18
3CAN_SCK  (via drill 0.3)
  Top 0.152: v83.74,35.81 81.84,35.81 U7.16
  Bottom 0.152: v83.74,35.81 93.5,35.81 93.95,36.27 94.18,36.27 94.26,36.2 95.48,36.2 95.94,36.65 96.24,36.65 97.16,37.57 X1.23
3RELAY1  (via drill 0.3)
  Top 0.152: v84.58,34.52 84.51,34.59 81.84,34.59 U7.14 | v85.65,33.45 85.95,33.45 91.97,27.43 94.79,27.43 X1.16
  Bottom 0.152: v85.65,33.45 v84.58,34.52
3RELAY2
  Top 0.152: X1.18 89.92,29.95 85.88,33.98 81.84,33.98 U7.13
!RTC_INT  (via drill 0.3)
  Top 0.152: v65.46,23.55 65.46,23.16 R32.2 | U8.3 65.08,25.15 65.08,24.84 65.53,24.38 v66.29,24.38 66.29,24.69 v68.43,26.82
  Bottom 0.152: v65.46,23.55 v66.29,24.38 | v68.43,26.82 80.92,39.32 93.57,39.32 94.34,40.08 94.79,40.08 X1.26
+3V  (via drill 0.3)
  Top 0.152: 59.36,30.25 59.36,37.19 v59.66,37.49 | 73.61,11.89 77.5,11.89 77.95,11.43 U6.4 78.03,11.35 78.03,8.76 U6.2 | 73.61,11.89 72.39,11.89 C43.2 | C20.1 73.53,8 v73.61,8.08 | 73.61,11.89 v73.61,9.3 | 87.63,51.59 90.07,51.59 C24.1 90.87,52.39 | 90.87,52.39 90.91,52.43 90.91,53.34 R29.1 | v85.11,51.59 83.59,51.59 U5.8 | 87.63,51.59 v86.26,51.59 | 87.63,51.59 C25.1 | R38.2 84.35,24.16 84.35,26.67 R40.2 79.55,26.67 v79.48,26.59 | 64.77,20.73 62.26,20.73 | 62.26,20.73 58.45,20.73 C21.2 | v68.43,23.09 R33.2 | v67.67,22.33 66.37,22.33 64.77,20.73 | 64.77,20.73 R32.1 | v70.1,27.74 69.49,28.35 69.49,30.48 R31.2 | v80.24,32.84 80.24,36.88 81.15,37.8 81.76,37.8 U7.19 81.84,37.8 84.35,37.8 84.89,37.26 85.04,37.26 C26.1 85.11,37.26 85.19,37.34 C27.1 91.06,33.91 95.33,33.91 96.24,34.82 96.24,40.62 97.84,42.22 97.84,50.37 97.61,50.6 93.42,50.6 91.67,52.35 90.91,52.35 90.87,52.39 | 62.26,20.73 62.26,23.7 D6.+
  Bottom 0.152: CN1.1 60.96,38.79 v59.66,37.49 59.74,37.49 59.74,34.75 68.2,26.29 70.1,26.29 | v73.61,8.08 v73.61,9.3 73.61,16.46 67.74,22.33 v67.67,22.33 v68.43,23.09 70.1,24.77 70.1,26.29 | v86.26,51.59 v85.11,51.59 | 70.1,26.29 v70.1,27.74 78.33,27.74 78.37,27.7 | 78.37,27.7 v79.48,26.59 | v80.24,32.84 80.24,29.57 78.37,27.7
+5V  (via drill 0.3)
  Top 0.203: 33.6,62.48 30.86,62.48 30.25,63.09 RELAY2.2 | 33.6,62.48 D3.C | 32.08,47.24 D2.C | 32.08,47.24 30.25,45.41 RELAY1.2 30.33,45.34 30.33,43.13 33.6,39.85 33.6,38.63 28.88,33.91 28.88,31.24 | R5.2 28.88,31.24 | 28.88,31.24 29.95,31.24 32.23,33.53 C3.1 39.4,33.45 39.4,27.28 48.35,18.33 | 33.6,62.48 33.6,56.39 28.88,51.66 28.88,50.52 32.08,47.32 32.08,47.24 | X1.4 94.79,12.12 94.79,9.68 X1.2 94.72,9.68 80.7,9.68 79.55,8.53 U6.3 79.48,8.46 78.56,7.54 74.98,7.54 73.84,8.69 73.23,8.69 72.92,8.99 71.32,8.99 67.74,12.57 C13.P$P 67.67,12.65 65.3,12.65 59.51,18.44 58.6,18.44 53.53,23.51 | v74.45,34.67 74.45,33.22 74.98,32.69 75.67,32.69 U7.10 | v73.23,35.89 73.23,36.5 73.38,36.65 73.38,38.02 72.47,38.94 C28.1 72.39,39.01 68.58,39.01 C29.1 68.5,38.94 62.56,38.94 61.72,38.1 59.44,38.1 58.06,36.73 v58.06,32.77 | v74.45,38.56 74.45,38.41 74.98,37.87 75.67,37.87 U7.2 | U1.18 46.86,31.77 47.78,31.77 48.77,32.77 50.44,32.77 51.44,31.77 51.66,31.77 R2.2 51.74,31.7 v51.74,28.5 | 18.52,21.87 17.83,21.18 17.83,20.88 C4.1 17.75,20.8 17.75,20.19 16.54,18.97 15.47,18.97 14.78,19.66 14.48,19.66 R4.2 | 18.52,21.87 18.52,23.85 18.44,23.93 U2.3 | 48.35,18.33 41.07,11.05 U4.3 38.79,9.07 35.59,9.07 C10.2 35.59,9.14 34.82,9.91 34.82,14.71 27.66,21.87 18.52,21.87 | 48.35,18.33 53.53,23.51 | 53.53,23.51 54.1,24.08 R6.2 54.03,24.16 52.73,25.45 v52.73,27.51
  Bottom 0.203: v74.45,34.67 v73.23,35.89 73.23,35.97 74.45,37.19 v74.45,38.56 | v51.74,28.5 v52.73,27.51 52.81,27.51 v58.06,32.77
ANTON
  Top 0.152: U5.13 73.84,49.38 70.41,49.38 69.88,49.91 R18.2
BAT_BACKUP
  Top 0.152: 52.88,45.87 BAT1.+ 52.96,45.87 57.15,41.68 57.15,39.09 55.24,37.19 D5.+
CAN_CS  (via drill 0.3)
  Top 0.152: v69.95,43.66 70.1,43.66 75.21,38.56 75.67,38.56 U7.1 | v56.62,40.92 55.93,40.92 54.41,39.4 54.41,38.94 47.85,32.38 45.8,32.38 45.64,32.23 45.64,30.02 46.41,29.26 46.79,29.26 U1.16
  Bottom 0.152: v69.95,43.66 67.21,40.92 v56.62,40.92
CAN_INT  (via drill 0.3)
  Top 0.152: U1.12 46.86,24.16 49.99,24.16 INT.- 49.99,24.23 49.99,25.53 52.5,28.04 v56.92,28.04 | v59.44,28.65 59.66,28.65 63.17,32.16 70.71,32.16 73.76,35.2 75.67,35.2 U7.6
  Bottom 0.152: v59.44,28.65 58.83,28.04 v56.92,28.04
CAN_MISO
  Top 0.152: U7.4 75.67,36.5 74.6,36.5 70.56,32.46 63.02,32.46 59.74,29.18 53.19,29.18 51.97,27.96 46.86,27.96 U1.15
CAN_MOSI
  Top 0.152: U1.14 46.02,26.67 45.03,27.66 45.03,41.68 51.74,48.39 53.87,48.39 58.6,43.66 69.19,43.66 73.38,39.47 73.38,38.86 75.06,37.19 U7.3
CAN_SCK  (via drill 0.3)
  Top 0.152: v58.83,44.2 71.25,44.2 76.66,38.79 76.66,36.2 76.35,35.89 75.74,35.89 U7.5 | v56.31,41.68 54.1,41.68 51.89,39.47 51.89,38.94 45.34,32.38 45.34,27.81 45.87,27.28 47.85,27.28 48.01,27.13 48.01,26.21 47.24,25.45 46.86,25.45 U1.13
  Bottom 0.152: v56.31,41.68 v58.83,44.2
CANH
  Top 0.152: J10.2 14.02,6.4 13.72,6.71 P1.2 13.72,14.4 14.4,15.09 14.4,17.98 12.46,19.93 | U2.7 17.14,25.3 16.46,24.61 16.46,22.33 14.33,22.33 14.1,22.1 14.1,21.34 13.64,20.88 13.41,20.88 12.46,19.93 | 12.46,19.93 10.36,17.83 7.77,17.83 J1.3
CANL  (via drill 0.3)
  Top 0.152: R43.2 18.21,11.66 18.21,7.24 19.05,6.4 J10.1 18.21,7.16 16.76,7.16 14.63,5.03 13.49,5.03 7.77,10.74 J1.5 | v19.13,22.86 19.13,24.61 18.44,25.3 18.44,29.34 U2.6
  Bottom 0.152: v19.13,22.86 8.61,12.34 7.77,12.34 J1.5
COM1
  Top 0.152: CHANNEL1.2 8.91,43.13 28.42,43.13 32.16,39.4 RELAY1.1
COM2
  Top 0.152: CHANNEL2.2 8.91,59.66 29.64,59.66 32.16,57.15 RELAY2.1
GND  (via drill 0.35)
  other vias: 48.9,42.55 52.7,34.92 55.24,26.04 26.04,28.57 19.05,19.05 20.95,26.67 14.61,26.67 10.79,19.68 11.43,11.43 14.61,30.48 71.75,3.17 90.81,6.99 74.93,29.84 62.23,29.21 65.41,31.11 81.28,28.57 92.08,28.57 92.08,34.92 92.08,36.83 88.27,34.92 85.72,44.45 47.62,33.66 49.53,29.84 60.33,19.68 67.94,20.32 76.2,22.23 84.45,21.59 89.53,20.95 89.53,17.78 91.44,22.23 92.08,24.13 83.19,25.4 84.45,31.11 83.82,33.02 90.81,40.64 71.12,31.11 73.66,26.64 70.48,35.56 34.92,52.07 40.01,51.44 41.91,54.61 73.03,53.98 71.75,52.07 43.81,41.27 43.18,43.81 60.96,22.23 69.22,9.53 71.12,11.43 74.3,10.79 17.78,26.04 56.52,29.84
  pour Top: -1.27,68.58 -1.27,-1.27 101.6,-1.27 101.6,68.58 85.09,68.58 85.09,58.42 80.64,58.42 80.64,68.58
  pour Bottom: -1.27,68.83 -1.27,-1.27 101.6,-1.27 101.6,68.58 85.09,68.58 85.09,58.42 80.64,58.42 80.64,68.58
GPS_1PPS
  Top 0.152: R34.1 87.94,44.96 89.69,43.2 93.5,43.2 R16.1
GPS_STANDBY
  Top 0.152: R30.1 90.22,46.25 95.33,46.25 96.01,46.94 97,46.94 97.23,46.71 97.23,42.06 95.94,40.77 95.94,36.12 94.87,35.05 X1.22
GPS_UART0_RX
  Top 0.152: R35.1 90.14,42.37 88.54,42.37 88.01,41.83 83.44,41.83 79.25,37.64 79.25,27.58 77.95,26.29 77.95,25.83 83.67,20.12 91.97,20.12 94.79,17.3 X1.8
GPS_UART0_TX
  Top 0.152: R36.1 83.21,41.15 79.7,37.64 79.7,32.61 84.66,27.66 88.32,27.66 88.92,27.05 88.92,26.06 94.79,20.19 94.79,19.81 X1.10
N$2
  Top 0.152: 14.71,21.57 TX.+ 14.78,21.57 16,20.34 R4.1
N$4
  Top 0.203: R12.2 39.47,57.15 39.7,57.38 Q2.1
N$5
  Top 0.203: R9.2 38.56,62.18 38.33,62.18 35.59,59.44 D3.A 35.51,59.36 35.51,57.84 33.98,56.31 33.98,54.94 30.25,51.21 RELAY2.3
N$6
  Top 0.203: R8.1 40.16,46.94 40.16,44.65 40.62,44.2 Q1.3
N$7
  Top 0.203: R8.2 38.56,46.94 38.33,46.94 35.59,44.2 D2.A 35.51,44.12 35.51,42.6 33.98,41.07 33.98,37.11 30.25,33.38 RELAY1.3
N$8
  Top 0.203: R9.1 40.16,62.18 40.16,59.89 40.62,59.44 Q2.3
N$9
  Top 0.152: INT2.+ 96.58,49.34 | 96.58,49.34 96.55,49.3 96.55,47.78 R16.2 | 96.58,49.34 96.55,49.38 94.18,49.38 94.03,49.53 J5.2
N$10
  Top 0.152: R17.2 49.07,2.21 47.93,2.21 STATUS.+ 47.85,2.21 47.85,4.8 47.62,5.03 J4.2
N$11
  Top 0.152: R42.1 18.14,13.41 16.23,13.41 16.15,13.34 R3.1
N$12
  Top 0.152: INT5.- 36.35,37.11 36.35,35.59 R14.2
N$13
  Top 0.152: R15.2 36.35,50.83 36.35,52.65 INT4.-
N$15
  Top 0.152: R5.1 22.86,28.73 23.62,27.96 RX.+
N$16
  Top 0.152: C1.2 21.64,24.84 26.06,24.84 26.75,24.16 X2.2 27.74,25.07 32,25.07 32.92,24.16 36.96,24.16 U1.7
N$17
  Top 0.152: 32.23,22.86 32.23,23.47 31.62,24.08 X2.1 | 32.23,22.86 32.23,20.34 C2.2 | 32.23,22.86 U1.8
N$19
  Top 0.152: INT.+ 51.59,24.16 52.58,24.16 R6.1
N$20
  Top 0.152: R1.1 13.49,29.26 15.77,29.26 15.85,29.34 U2.8
N$23
  Top 0.203: R10.2 39.47,41.91 39.7,42.14 Q1.1
N$26
  Top 0.305: C7.2 35.51,13.87 35.51,16.15 35.2,16.46 D4.- 35.59,16.08 40.77,16.08 U4.1
N$29
  Top 0.152: 55.93,2.29 56.77,2.29 R19.2 | 55.93,2.29 POWER.+ | 55.93,2.29 55.93,5.03 J3.2
N$30
  Top 0.152: P1.1 14.48,12.65 15.01,12.65 16.08,11.58 R3.2
N$31
  Top 0.152: C9.2 78.11,57.07 78.18,57.15 C8.2 C6.1
N$32
  Top 0.152: C11.2 81.31,55.55 81.31,57.07 81.38,57.15 C6.2 81.46,57.15 82.64,58.33 arc45 83.21,59.71 83.21,62.56 ANT2.FEED
N$33
  Top 0.152: L7.2 74.91,54.94 74.91,56.77 74.52,57.15 L5.1 74.45,57.15 73.69,56.39 72.92,56.39 U3.3
N$34
  Top 0.152: C8.1 L5.2
N$35
  Top 0.152: U3.5 71.86,55.85 71.48,55.85 70.56,54.94 70.56,52.43 69.88,51.74 R18.1
N$36
  Top 0.152: U3.4 71.86,56.39 70.1,56.39 C23.1 69.8,56.69 67.36,56.69 C12.1 66.06,55.4 66.06,50.44 R22.1
N$37
  Top 0.152: R27.1 71.4,46.94 72.92,46.94 73.84,46.02 U5.16
N$38
  Top 0.152: R28.1 73,45.72 73.69,45.03 73.84,45.03 U5.17
N$39
  Top 0.152: R29.2 88.32,53.34 87.25,52.27 86.18,52.27 85.65,51.74 85.65,51.28 83.74,49.38 83.59,49.38 U5.6
N$40
  Top 0.152: C18.2 86.33,18.52 86.03,18.52 85.34,17.83 X4.1 85.34,17.91 83.13,20.12 70.64,20.12 67.89,22.86 67.06,22.86 65.84,24.08 65.3,24.08 64.54,24.84 64.54,25.15 U8.2
N$41  (via drill 0.3)
  Top 0.152: X4.2 82.3,17.83 81.61,18.52 81.31,18.52 C17.2 81.23,18.59 71.7,18.59 68.58,21.72 v66.52,21.72 | v64.69,23.55 64.08,24.16 64.08,25.15 U8.1
  Bottom 0.152: v66.52,21.72 v64.69,23.55
N$42
  Top 0.152: R30.2 90.14,47.78 84.05,47.78 83.59,48.23 U5.5
N$43
  Top 0.152: R34.2 84.35,46.48 83.74,47.09 83.59,47.09 U5.4
N$44
  Top 0.152: R37.2 87.63,53.8 84.66,53.8 83.59,52.73 U5.9
N$45
  Top 0.152: R43.1 19.74,11.73 19.74,13.41 R42.2
N$49  (via drill 0.3)
  Top 0.152: 60.58,28.12 58.52,28.12 58.48,28.16 | 60.58,28.12 62.18,28.12 | 62.18,28.12 64.01,28.12 U8.8 | 58.45,28.19 58.48,28.16 | C19.1 58.45,26.21 58.45,28.12 58.48,28.16 | 62.18,28.12 62.18,27.05 D6.- | v59.51,29.72 59.44,29.72 56.54,32.61 55.24,32.61 D5.- | 60.58,28.12 v60.58,28.8
  Bottom 0.152: v59.51,29.72 59.66,29.72 v60.58,28.8
NC1
  Top 0.152: CHANNEL1.1 8.91,39.62 11.73,39.62 17.98,33.38 RELAY1.5
NC2
  Top 0.152: CHANNEL2.1 8.91,56.16 13.03,56.16 17.98,51.21 RELAY2.5
NO1
  Top 0.152: CHANNEL1.3 8.91,46.63 16.76,46.63 17.98,45.41 RELAY1.4
NO2
  Top 0.152: CHANNEL2.3 8.91,63.17 17.98,63.17 RELAY2.4
POWERLED  (via drill 0.3)
  Top 0.152: v73.61,7.32 68.89,2.59 58.6,2.59 R19.1
  Bottom 0.152: v73.61,7.32 93.34,27.05 93.34,28.04 93.95,28.65 94.18,28.65 94.26,28.57 95.48,28.57 95.94,29.03 96.24,29.03 97.16,29.95 X1.17
RELAY1
  Top 0.203: R10.1 36.12,41.91 36.12,39.7 36.73,39.09 INT5.+ 36.73,39.01 38.25,39.01 R11.1 39.32,40.08 40.92,40.08 49.61,48.77 54.03,48.77 57.91,44.88 71.09,44.88 77.04,38.94 77.04,35.28 76.35,34.59 75.74,34.59 U7.7
RELAY2
  Top 0.152: R12.1 36.12,57.15 36.12,54.41 36.27,54.25 INT4.+ 36.35,54.25 38.25,54.25 R13.2 38.63,54.56 39.32,53.87 50.9,53.87 59.51,45.26 71.25,45.26 77.42,39.09 77.42,35.05 76.35,33.98 75.74,33.98 U7.8
RF_IN
  Top 0.152: U3.6 71.93,55.32 71.93,53.42 73.84,51.51 U5.11
RFIDRX  (via drill 0.3)
  Top 0.152: v52.27,21.41 52.27,5.18 50.98,3.89 50.98,2.59 R17.1 50.98,2.52 51.89,1.6 88.39,1.6 95.94,9.14 95.94,10.36 96.32,10.74 97.54,10.74 98.83,12.04 98.83,21.34 98.68,21.49 v98.68,23.7
  Bottom 0.152: v52.27,21.41 52.27,27.2 51.21,28.27 51.21,36.96 53.34,39.09 CN1.4 | v98.68,23.7 97.54,24.84 97.38,24.84 X1.13
RFIDTX  (via drill 0.3)
  Top 0.152: v57.45,28.65 57.45,20.19 58.83,18.82 71.02,18.82 71.63,18.21 80.39,18.21 82.75,15.85 95.71,15.85 96.01,15.54 96.55,15.54 97.08,16.08 97.84,16.08 98.53,16.76 98.53,21.18 97.38,22.33 X1.11
  Bottom 0.152: v57.45,28.65 58.6,29.79 58.6,35.89 55.93,38.56 55.93,39.32 CN1.3
RST_N  (via drill 0.3)
  Top 0.152: 48.92,31.7 48.39,31.7 47.17,30.48 U1.17 | 48.92,31.7 49.91,31.7 R2.1 | 87.63,55.32 94.41,55.32 98.53,51.21 98.53,24.38 97.61,23.47 96.85,23.47 96.24,22.86 96.24,18.36 X1.7 | v48.92,32.08 48.92,31.7 | v58.75,46.79 58.75,49.3 67.28,57.84 80.39,57.84 80.7,57.53 80.7,54.94 81.08,54.56 86.87,54.56 87.63,55.32 | 87.63,55.32 R37.1
  Bottom 0.152: v48.92,32.08 48.92,35.51 52.05,38.63 52.05,38.86 52.2,39.01 52.2,39.78 52.05,39.93 52.05,40.08 v58.75,46.79
RTC_CLKOUT  (via drill 0.3)
  Top 0.152: v78.72,32.08 78.49,31.85 67.59,31.85 64.54,28.8 64.54,28.19 U8.7 | v81.92,32 86.94,32 92.66,26.29 96.24,26.29 X1.15
  Bottom 0.152: v78.72,32.08 80.01,33.38 80.54,33.38 v81.92,32
RTC_SCL  (via drill 0.3)
  Top 0.152: U8.6 65.08,28.19 65.08,28.5 67.06,30.48 R31.1 67.74,30.48 67.74,29.34 69.88,27.2 v78.11,27.2 | v96.24,16.08 96.24,17.45 95.33,18.36 94.26,18.36 88.54,24.08 88.16,24.08 R39.2 88.09,24.16 85.88,24.16 R38.1 85.11,23.39 83.9,23.39 81.46,25.83 v79.48,25.83
  Bottom 0.152: v96.24,16.08 97.31,15.01 97.31,14.71 X1.5 | v79.48,25.83 v78.11,27.2
RTC_SDA  (via drill 0.3)
  Top 0.152: R41.2 R40.1 85.5,26.67 84.81,27.36 79.48,27.36 78.49,26.36 v78.49,26.06 | U8.5 65.53,28.12 67.97,28.12 69.8,26.29 R33.1 69.88,26.29 70.1,26.06 v77.42,26.06 | v80.16,17.68 84.28,13.56 95.02,13.56 96.39,12.19 97.31,12.19 X1.3
  Bottom 0.152: v77.42,26.06 v78.49,26.06 80.16,24.38 v80.16,17.68
RX_CAN
  Top 0.152: 22.1,27.2 22.1,26.59 19.74,24.23 19.74,24 U2.4 | 22.1,27.2 RX.- | U1.2 30.18,30.48 26.9,27.2 22.1,27.2
RXD1
  Top 0.152: R35.2 90.14,43.97 89.84,43.97 88.01,45.8 83.82,45.8 83.59,46.02 U5.3
TX_CAN
  Top 0.152: TX.- 13.79,22.17 13.79,22.25 15.47,23.93 15.85,23.93 U2.1 15.93,24 15.93,24.54 16.46,25.07 16.46,30.02 16.84,30.4 29.64,30.4 30.94,31.7 36.96,31.7 U1.1
TXD1
  Top 0.152: R36.2 86.03,42.67 83.74,44.96 U5.2
V+
  Top 0.305: J2.+ 31.09,10.21 30.94,10.36 30.94,16.38 D4.+ 30.86,16.54 27.96,16.54 VIN.T 27.81,16.54 22.86,16.54 22.1,17.3 21.26,17.3 C5.P$P 21.11,17.37 20.27,16.54 17.53,16.54 D1.-
V_OBD
  Top 0.305: D1.+ 12.95,16.46 10.9,16.46 8.15,13.72 4.95,13.72 J1.9
VCC_RF
  Top 0.152: R22.2 66.37,48.31 73.84,48.31 U5.14

### Text on the board
silktop: External Control | RFID UART | CAN to Vehicle | Raspberry Pi / Header | OpenAuto.ch Car Sharing | 15V Max | J.Devine CERN OHL v1.2
silkbottom: github.com/pingud98/OpenAutoChPiHat